# Altium project Energieversorgung.PrjPcb
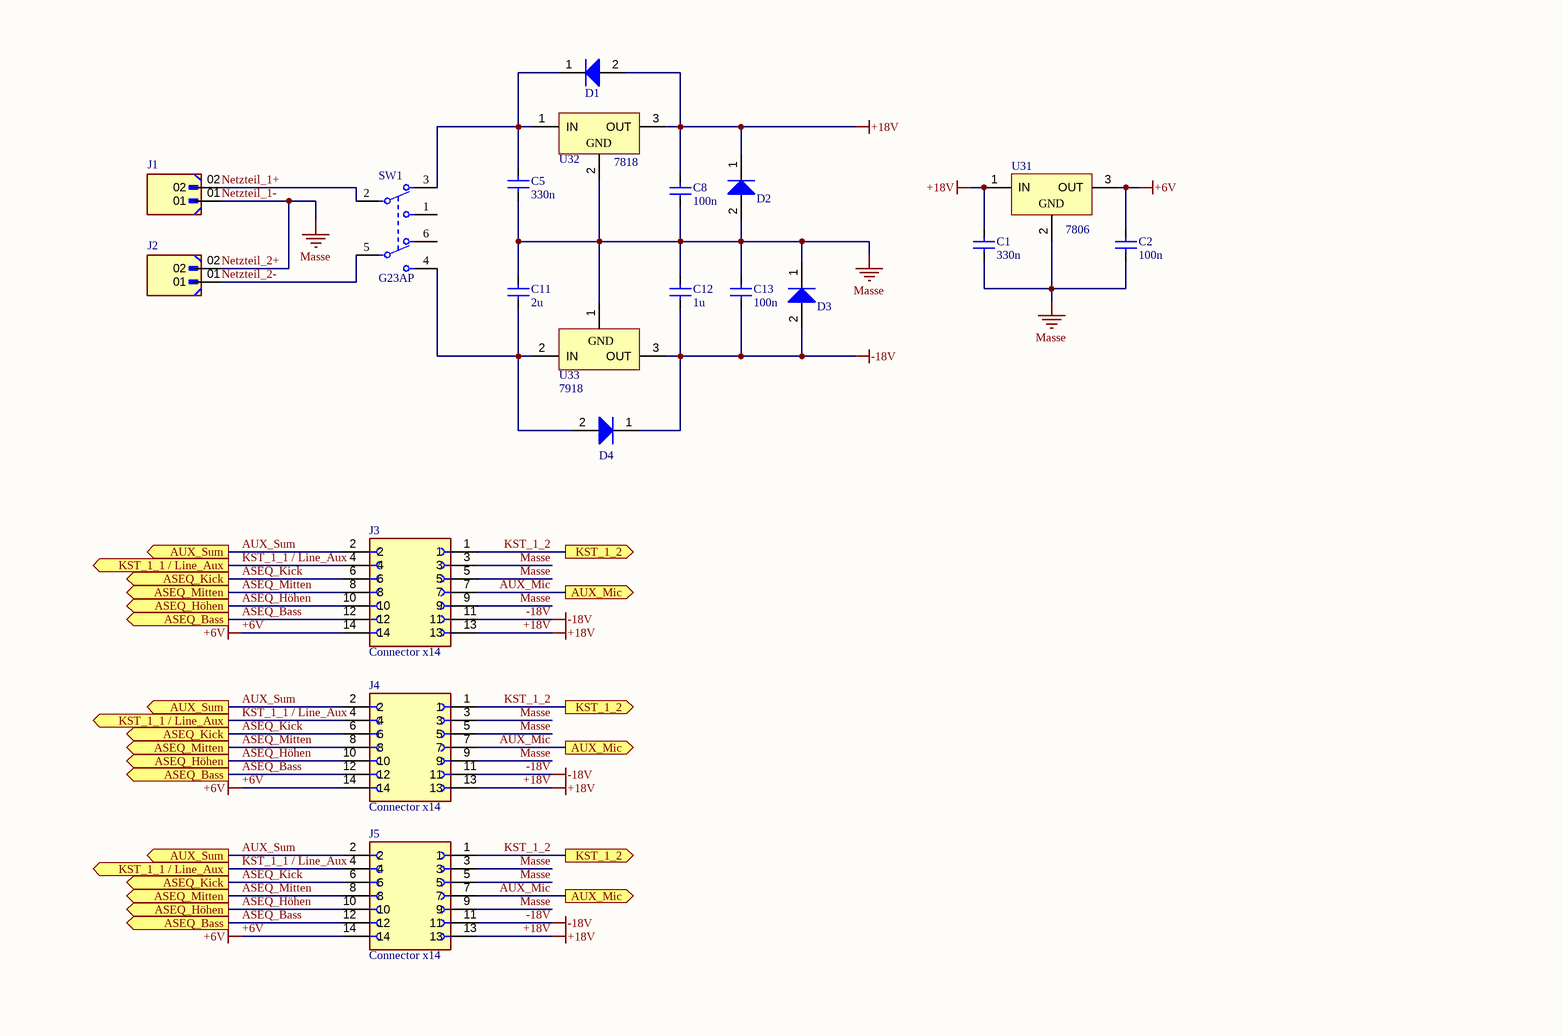
[diagram p0: Energieversorgung.SchDoc]
1 sheet, 20 parts. Net scope: flat (ports and power ports of the same name join across sheets).
Board file: Energieversorgung.PcbDoc

## Sheet Energieversorgung.SchDoc
size A4

### Parts
C1  330n  [0805]
C2  100n  [0805]
C5  330n  [0805]
C8  100n  [0805]
C11  2u  [0805]
C12  1u  [0805]
C13  100n  [0805]
D1  1N4001 Diode  [1N4001 Diode]  (value not drawn)
D2  1N4001 Diode  [1N4001 Diode]  (value not drawn)
D3  1N4001 Diode  [1N4001 Diode]  (value not drawn)
D4  1N4001 Diode  [1N4001 Diode]  (value not drawn)
J1  Connector x2  [Connector x2]  (value not drawn)
J2  Connector x2  [Connector x2]  (value not drawn)
J3  Connector x14  [Connector x14]
J4  Connector x14  [Connector x14]
J5  Connector x14  [Connector x14]
SW1  G23AP  [Connector x4]
U31  7806  [TO220 Spannungsregler 78xx]
U32  7818  [TO220 Spannungsregler 78xx]
U33  7918  [TO220 Spannungsregler 79xx]

### Ports
ASEQ_Bass (out), ASEQ_Höhen (out), ASEQ_Kick (out), ASEQ_Mitten (out), AUX_Mic (out), AUX_Sum (out), KST_1_1 / Line_Aux (out), KST_1_2 (out)

### Nets
+6V: C2.2 J3.14 J4.14 J5.14 U31.3(OUT)
+18V: C1.2 C8.2 D1.2(A) D2.1(K) J3.13 J4.13 J5.13 U31.1(IN) U32.3(OUT)
-18V: C12.2 C13.1 D3.2(A) D4.1(K) J3.11 J4.11 J5.11 U33.3(OUT)
Masse: C1.1 C2.1 C5.1 C8.1 C11.1 C12.1 C13.2 D2.2(A) D3.1(K) J1.01 J2.02 J3.3 J3.5 J3.9 J4.3 J4.5 J4.9 J5.3 J5.5 J5.9 U31.2(GND) U32.2(GND) U33.1(GND)  [also labelled Netzteil_1-, Netzteil_2+]
ASEQ_Bass: J3.12 J4.12 J5.12 ; port ASEQ_Bass
ASEQ_Höhen: J3.10 J4.10 J5.10 ; port ASEQ_Höhen
ASEQ_Kick: J3.6 J4.6 J5.6 ; port ASEQ_Kick
ASEQ_Mitten: J3.8 J4.8 J5.8 ; port ASEQ_Mitten
AUX_Mic: J3.7 J4.7 J5.7 ; port AUX_Mic
AUX_Sum: J3.2 J4.2 J5.2 ; port AUX_Sum
KST_1_1 / Line_Aux: J3.4 J4.4 J5.4 ; port KST_1_1 / Line_Aux
KST_1_2: J3.1 J4.1 J5.1 ; port KST_1_2
Netzteil_1+: J1.02 SW1.2
Netzteil_2-: J2.01 SW1.5
NetC5_2: C5.2 D1.1(K) SW1.3 U32.1(IN)
NetC11_2: C11.2 D4.2(A) SW1.4 U33.2(IN)

Not connected (* = marked no-connect by the designer): SW1 1 6

### Library data of the parts
C1 C2 C5 C8 C11-C13 = 0805 Kondensator
  C1 C5: Value: 330n
  C2 C8 C13: Value: 100n
  C11: Value: 2u
  C12: Value: 1u
D1-D4 = 1N4001 Diode: Standard Recovery Rectifier, 2-Pin Axial_Lead, Pb-Free, Bulk Bag; Manufacturer: On Semiconductor; VRRM Max (V): 50; IFSM Max (A): 30; IO(rec) Max (A): 1; ComponentLink3URL: http://www.onsemi.cn/pub_link/Collateral/59-10.PDF; ComponentLink3Description: Package Specification; PartNumber: 1N4001; PackageVersion: Rev. U, 02/2005; Packing: Bulk Bag; ComponentLink2Description: Datasheet; RoHS: TRUE; DatasheetVersion: Rev. 13; PackageReference: AXIAL_LEAD-2-59-10; ComponentLink1URL: http://www.onsemi.com/; Mounting Technology: Through Hole; PackageDescription: 2-Pin, Axial Lead, Diameter 2.35 mm; ComponentLink2URL: http://www.onsemi.com/pub_link/Collateral/1N4001-D.PDF; Type: Standard Recovery; ComponentLink1Description: Manufacturer URL
J1 J2 = Connector x2: Connector Header Through Hole 2 position 0.100 (2.54mm); MF: Wurth Elektronik; MP: 61300211121; SnapEDA_Link: https://www.snapeda.com/parts/61300211121/Wurth+Elektronik/view-part/?ref=snap; Package: None; Value: *; Check_prices: https://www.snapeda.com/parts/61300211121/Wurth+Elektronik/view-part/?ref=eda
J3-J5 = Connector x14: 14 Position Header Connector Through Hole; MF: Sullins Connector; MP: SFH11-PBPC-D07-ST-BK; Value: *; Check_prices: https://www.snapeda.com/parts/SFH11-PBPC-D07-ST-BK/Sullins%20Connector%20Solutions/view-part/851415/?ref=eda; Availability: Warning; Package: None; SnapEDA_Link: https://www.snapeda.com/parts/SFH11-PBPC-D07-ST-BK/Sullins%20Connector%20Solutions/view-part/851415/?ref=snap; Purchase-URL: https://pricing.snapeda.com/search/part/SFH11-PBPC-D07-ST-BK/?ref=eda; Price: None; System: Connector
SW1 = Schalter 2x3: SWITCH TOGGLE DPDT 0.4VA 28V; pin to pad: 1>none 2>1 3>4 4>none 5>3 6>2; Contact Current Rating: 100mA; Illumination Type: Non-Illuminated; Actuator Type: Standard Round; Electrical Life: 100000Cycles; Actuator Length: 3.8mm; Insulation Resistance: 500MR; Power Rating: 400mW; Actuator Material: Nylon; Switch Function: On-Off-On; Contact Plating: Gold; Voltage Rating (DC): 28V; RoHS Compliant: Yes; Min Operating Temperature: -25°C; Length: 7mm; Orientation: Vertical; Mount: Through Hole; Max Operating Temperature: 85°C; Lead Free: Lead Free; Package Quantity: 1; Series: G; Termination: PC Pin; Depth: 4.5mm; Current Rating: 100mA; Throw Configuration: DPDT; Contact Material: Bronze; Housing Material: Polyamide; Max Current Rating: 100mA; Max Voltage Rating (DC): 28V; Max Voltage Rating (AC): 28V; Voltage Rating (AC): 28V; Packaging: Tray
U31 U32 = TO 220 Spannungsregler 78xx: Voltage Regulator, 3-Pin TO-220
  U31: Typ: 7806
  U32: Typ: 7818
U33 = TO 220 Spannungsregler 79xx: Voltage Regulator, 3-Pin TO-220; Typ: 7918